# EAGLE design pixie_bottle (EAGLE 6.4)
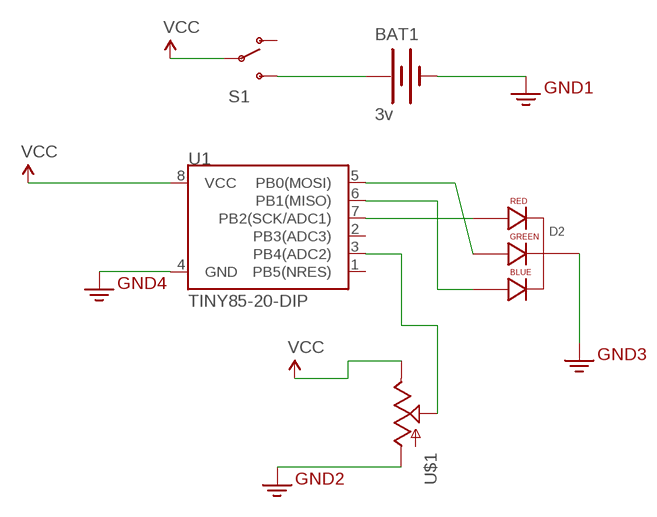
[diagram p0: schematic, sheet 1]

## Parts
BAT1  3v  BATTERY20PTH  [BATTCOM_20MM_PTH]
D2  LED-RGB-CC-THRUDIFFUSE  [LED-RGB-THRU]
S1  SWITCH-SPDTPTH  [SWITCH-SPDT]
U1  TINY85-20-DIP  ATTINY45TINY85-20-DIP  [DIP08]
U$1  POT-RV16AF-20  [POT_ALPHA_RV16AF-20]

## Nets
3.3V: BAT1.2(-) D2.2(CATHODE) U1.4(GND) U$1.1(A) ; supply symbol labelled GND2
N$1: D2.1(RED_CATHODE) U1.7(PB2(SCK/ADC1))
N$2: D2.3(GREEN_CATHODE) U1.5(PB0(MOSI))
N$3: D2.4(BLUE_CATHODE) U1.6(PB1(MISO))
N$4: U1.3(PB4(ADC2)) U$1.2(S)
N$5: BAT1.1(+) S1.3(S)
VCC: S1.2(P) U1.8(VCC) U$1.3(E)
Unconnected: S1.1(O) U1.1(PB5(NRES)) U1.2(PB3(ADC3))

## Library data of the parts
BAT1 = SparkFun-Electromechanical:BATTERY: Battery Holders Various common sizes : AA, AAA, 20mm coin cell and 12mm coin cell. 20MM_4LEGS, BATT-10373
D2 = SparkFun-LED:LED-RGB-CC-THRU: RGB Through-hole common cathode LED SparkFun Storefront: COM-00105 (Clear) COM-09264 (Diffuse); PROD_ID: DIO-09434
S1 = SparkFun-Electromechanical:SWITCH-SPDT: SPDT Switch Simple slide switch, Spark Fun Electronics SKU : COM-00102 DPDT SMT slide switch, AYZ0202, SWCH-08179
U1 = SparkFun-DigitalIC:ATTINY45: Atmel 8-pin 2/4/8kB flash uC; PROD_ID: IC-09445
U$1 = SparkFun-Electromechanical:POT

## Board
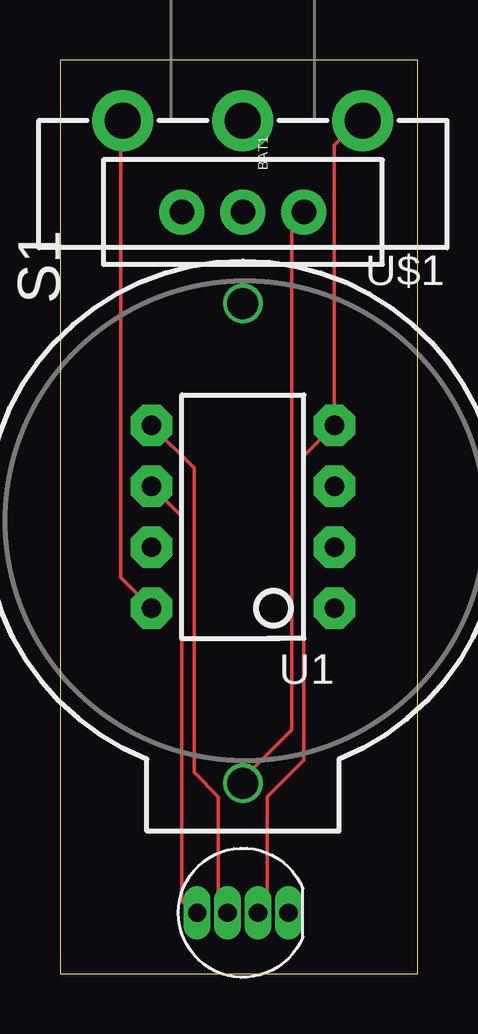
[diagram p1: board, top side]
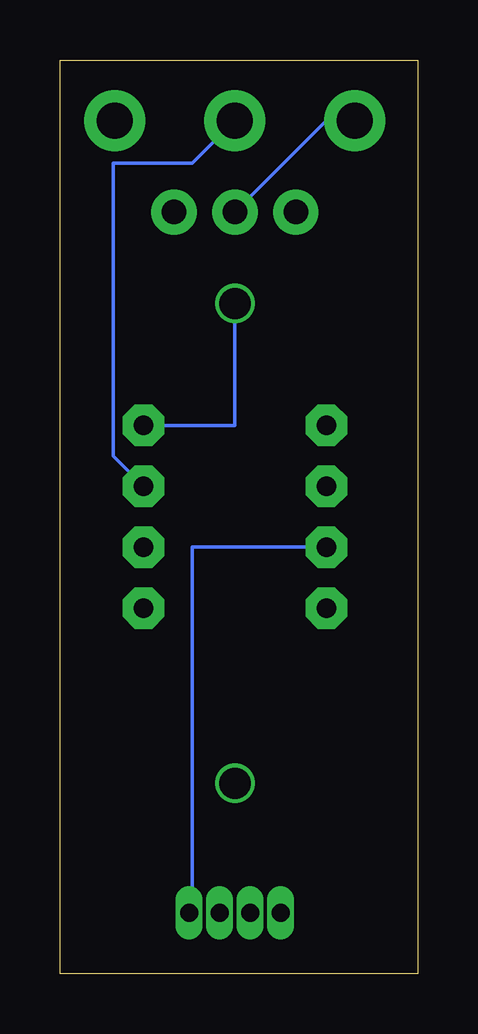
[diagram p2: board, bottom side, seen from below]

Size 14.91 x 38.09 mm. Coordinates in mm from the lower left corner, seen from the top.
Outline: 0,0 14.91,0 14.91,38.09 0,38.09 0,0
Copper layers (1*16): Top 0.035mm / dielectric 1.5mm / Bottom 0.035mm
Design rules "default *": minimum track width 6mil, minimum drill 13mil, track to track 6mil, track to pad 8mil, pad to pad 8mil, via to via 8mil, smd to smd 8mil, copper to edge 15mil, drill to drill 8mil, minimum pad ring 7mil, minimum via ring 7mil, stop-mask expansion 4mil, vias tented up to drill 0mil, thermal gap 10mil

### Footprints (pad centres in the part's own frame; a part is rotated, then mirrored left to right if it is on the bottom)
BATTCOM_20MM_PTH = drill 1.3: 1 20,0; 2 0,0
LED-RGB-THRU = drill 0.762 pad 0.889 long: 1 1.905,0; 2 0.635,0; 3 -0.635,0; 4 -1.905,0
SWITCH-SPDT = drill 1.016 pad 1.88: 1 0,2.54; 2 0,0; 3 0,-2.54
DIP08 = drill 0.813 pad 1.727 octagon: 1 -3.81,-3.81; 2 -1.27,-3.81; 3 1.27,-3.81; 4 3.81,-3.81; 5 3.81,3.81; 6 1.27,3.81; 7 -1.27,3.81; 8 -3.81,3.81
POT_ALPHA_RV16AF-20 = drill 1.5 pad 2.54: 1 -5,0; 2 0,0; 3 5,0

### Placement (x,y rotation side)
BAT1  7.62,27.94 270 top
D2  7.62,2.54 0 top
S1  7.62,31.75 90 top
U1  7.62,19.05 90 top
U$1  7.62,35.56 180 top

### Tracks (layer width: path | path; a pad name or v marks a point on that pad's centre or on a via)
3.3V
  Top 0.152: D2.2 8.38,2.54 8.64,2.79 8.64,7.37 10.16,8.89 10.16,21.59 U1.4 11.43,34.54 12.45,35.56 U$1.1
  Bottom 0.152: BAT1.2 7.62,22.86 U1.4
N$1
  Bottom 0.152: U1.7 9.4,17.78 9.4,2.54 D2.1
N$2
  Top 0.152: U1.5 5.59,21.08 5.59,8.38 6.6,7.37 6.6,2.79 6.86,2.54 D2.3
N$3
  Top 0.152: U1.6 5.08,19.05 5.08,3.05 5.59,2.54 D2.4
N$4
  Bottom 0.152: U1.3 12.7,21.59 12.7,33.78 9.4,33.78 U$1.2
N$5
  Top 0.152: S1.3 9.65,31.24 9.65,10.16 7.62,8.13 BAT1.1
VCC
  Top 0.152: U1.8 2.54,16.51 2.54,35.56 U$1.3
  Bottom 0.152: S1.2 3.81,35.56 U$1.3